# EAGLE schematic main (EAGLE 9.6.2)
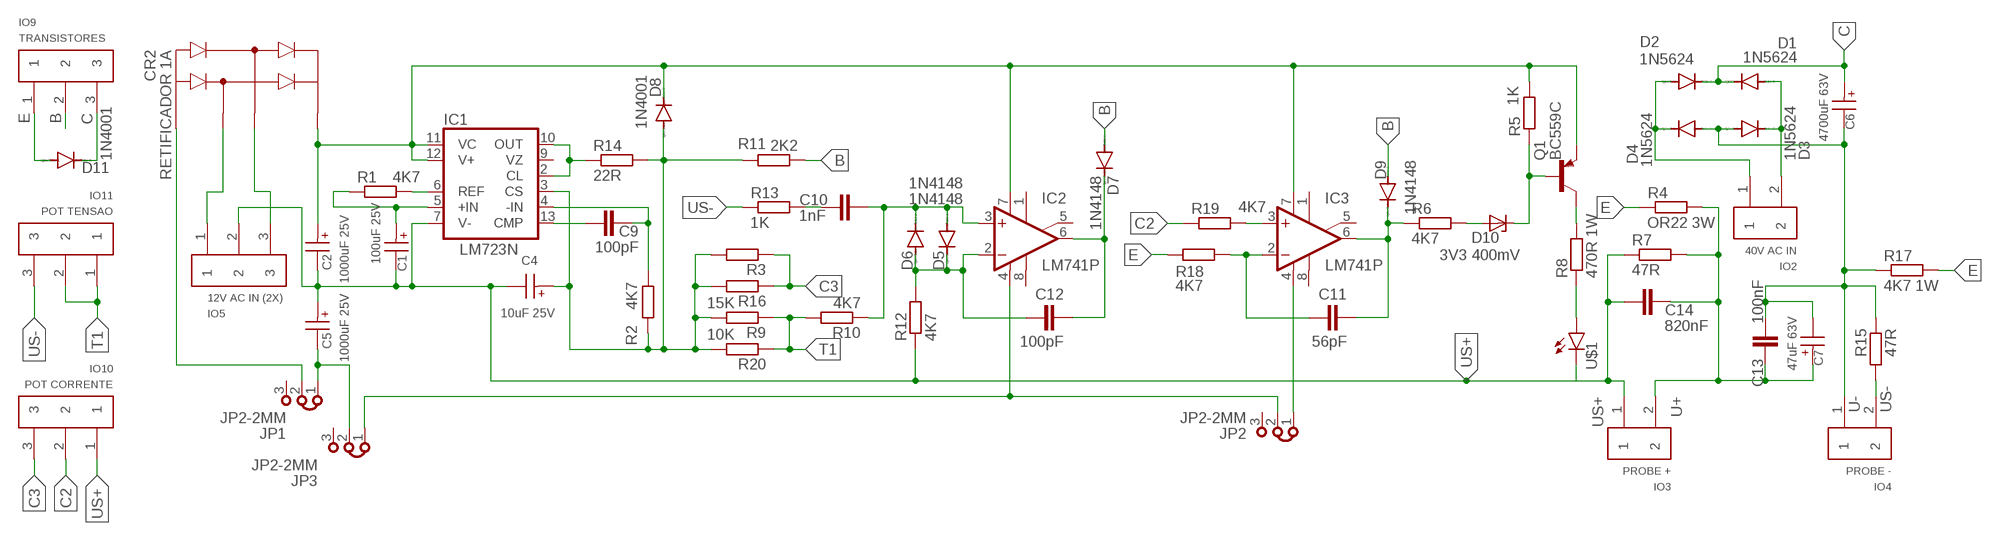
[diagram p0: schematic, sheet 1]

## Parts
C1  100uF 25V  WCAP-ATET_16X31.5_860131280009  [WCAP-ATET_16X31.5(DXL)]
C2  1000uF 25V  WCAP-ATET_16X31.5_860131280009  [WCAP-ATET_16X31.5(DXL)]
C4  10uF 25V  WCAP-ATET_16X31.5_860131280009  [WCAP-ATET_16X31.5(DXL)]
C5  1000uF 25V  WCAP-ATET_16X31.5_860131280009  [WCAP-ATET_16X31.5(DXL)]
C6  4700uF 63V  WCAP-AIG5_35X60_861021386035  [WCAP-AIG5_35X60(DXL)]
C7  47uF 63V  WCAP-AIG5_35X60_861021386035  [WCAP-AIG5_35X60(DXL)]
C9  100pF  C-EU025-025X050  [C025-025X050]
C10  1nF  C-EU025-025X050  [C025-025X050]
C11  56pF  C-EU025-025X050  [C025-025X050]
C12  100pF  C-EU025-025X050  [C025-025X050]
C13  100nF  C-EU025-025X050  [C025-025X050]
C14  820nF  C-EU025-025X050  [C025-025X050]
CR2  RETIFICADOR 1A  KBU8J-E4/51  [THT]
D1  1N5624  [DO201-15]
D2  1N5624  [DO201-15]
D3  1N5624  [DO201-15]
D4  1N5624  [DO201-15]
D5  1N4148  1N4148DO35-7  [DO35-7]
D6  1N4148  1N4148DO35-7  [DO35-7]
D7  1N4148  1N4148DO35-7  [DO35-7]
D8  1N4001  1N4148DO35-7  [DO35-7]
D9  1N4148  1N4148DO35-7  [DO35-7]
D10  3V3 400mV  ZENER-DIODEDO34-7  [DO34Z7]
D11  1N4001  1N4148DO35-7  [DO35-7]
IC1  LM723N  [DIL14]
IC2  LM741P  [DIL08]
IC3  LM741P  [DIL08]
IO2  40V AC IN  KRE-2P  [KRE-2P]
IO3  PROBE +  KRE-2P  [KRE-2P]
IO4  PROBE -  KRE-2P  [KRE-2P]
IO5  12V AC IN (2X)  KRE-3P  [KRE-3P]
IO9  TRANSISTORES  KRE-3P  [KRE-3P]
IO10  POT CORRENTE  KRE-3P  [KRE-3P]
IO11  POT TENSAO  KRE-3P  [KRE-3P]
JP1  JP2-2MM  JUMPERS_JP2-2MM  [JUMPERS_JP2-2MM]
JP2  JP2-2MM  JUMPERS_JP2-2MM  [JUMPERS_JP2-2MM]
JP3  JP2-2MM  JUMPERS_JP2-2MM  [JUMPERS_JP2-2MM]
Q1  BC559C  [TO92-EBC]
R1  4K7  R-EU_0204/7  [0204/7]
R2  4K7  R-EU_0204/7  [0204/7]
R3  R-EU_0204/7  [0204/7]
R4  OR22 3W  R-EU_0204/7  [0204/7]
R5  1K  R-EU_0204/7  [0204/7]
R6  4K7  R-EU_0204/7  [0204/7]
R7  47R  R-EU_0204/7  [0204/7]
R8  470R 1W  R-EU_0204/7  [0204/7]
R9  10K  R-EU_0204/7  [0204/7]
R10  4K7  R-EU_0204/7  [0204/7]
R11  2K2  R-EU_0204/7  [0204/7]
R12  4K7  R-EU_0204/7  [0204/7]
R13  1K  R-EU_0204/7  [0204/7]
R14  22R  R-EU_0204/7  [0204/7]
R15  47R  R-EU_0204/7  [0204/7]
R16  15K  R-EU_0204/7  [0204/7]
R17  4K7 1W  R-EU_0204/7  [0204/7]
R18  4K7  R-EU_0204/7  [0204/7]
R19  4K7  R-EU_0204/7  [0204/7]
R20  R-EU_0204/7  [0204/7]
U$1  CLIP  LED-CIRCULAR-5MM-VERMELHO  [LED-CIR-5MM-VERMELHO]

## Nets
B: D7.A D9.A IO9.2 R11.1
C: C6.1(+) D1.C D2.C D11.C IO9.3
C2: IO10.2 R19.1
C3: IO10.3 R3.1 R16.1
E: D11.A IO9.1 R4.1 R17.2 R18.1
N$7: CR2.2(~) IO5.1
N$8: CR2.3(~_1) IO5.3
N$9: C2.1(+) CR2.1(+) D8.C IC1.11(VC) IC1.12(V+) IC2.7(V+) IC3.7(V+) Q1.E R5.2
N$10: C1.1(+) IC1.5(+IN) R1.1
N$11: C5.2(-) JP1.1 JP3.2
N$12: CR2.4(-) JP1.2
N$14: IC1.6(REF) R1.2
N$15: C9.1 IC1.13(CMP)
N$16: C9.2 IC1.4(-IN) R2.2
N$17: D1.A D3.C IO2.2
N$18: D2.A D4.C IO2.1
N$19: C10.1 D5.A D6.C IC2.3(+IN) R10.1
N$20: IC1.2(CL) IC1.10(OUT) R14.1
N$21: C4.1(+) D8.A IC1.3(CS) R2.1 R3.2 R9.2 R11.2 R14.2 R16.2 R20.2
N$22: C12.1 D5.C D6.A IC2.2(-IN) R12.2
N$23: C10.2 R13.2
N$24: IC2.4(V-) JP2.2 JP3.1
N$25: IC3.4(V-) JP2.1
N$27: C11.1 IC3.2(-IN) R18.2
N$28: IC3.3(+IN) R19.2
N$29: D10.A R6.2
N$30: C12.2 D7.C IC2.6(OUT)
N$31: C11.2 D9.C IC3.6(OUT) R6.1
N$34: R8.1 U$1.A(ANODE)
N$35: Q1.C R8.2
N$36: D10.C Q1.B R5.1
T1: IO11.1 IO11.2 R9.1 R10.2 R20.1
U+: C7.1(+) C13.1 C14.1 IO3.2 R4.2 R7.2
U-: C6.2(-) C7.2(-) C13.2 D3.A D4.A IO4.1 R15.2 R17.1
US+: C1.2(-) C2.2(-) C4.2(-) C5.1(+) C14.2 IC1.7(V-) IO3.1 IO5.2 IO10.1 R7.1 R12.1 U$1.K(CATHODE)
US-: IO4.2 IO11.3 R13.1 R15.1
Unconnected: IC1.9(VZ) IC2.1(ON1) IC2.5(ON2) IC2.8(OPT) IC3.1(ON1) IC3.5(ON2) IC3.8(OPT) JP1.3 JP2.3 JP3.3

## Library data of the parts
C1 C2 C4 C5 = Wurth_Capacitors_WCAP-ATET:WCAP-ATET_16X31.5: WCAP-ATET Aluminium Electrolytic Capacitors High Temperature +125 °C Characteristics High operating temperature product series Mounting style: THT Radial Capacitance range: 0.47 µF ‒ 1000 µF Capacitance tolerance: ±20 % Voltage range (UR): 10 ‒ 350 V(DC) Operating temperature: -40 °C up to +125 °C for UR ≤100 V(DC) -25 °C up to +125 °C for UR >100 V(DC) Endurance: 1000 ‒ 2000 h @ +125 °C Dimensions (DxL) in mm: 5.0 x 11.0 up to 16.0 x 31.5 Recommended soldering: Wave soldering Applications High operating temperature applications Filtering Smoothing Energy storage Coupling e.g. Switched-mode power supply, AC/DC converter, adapter, charger, digital camera <https://www.we-online.com/catalog/media/o14728v209%20Family_WCAP-ATET.jpg> Details see: https://www.we-online.com/catalog/en/WCAP-ATET/ Updated by yingchun,Shan;2020-02-28 2020(C) Würth Elektronik; DATASHEET-URL: https://www.we-online.com/catalog/datasheet/860131280009.pdf; DF: 12%; DIAMETER: 16mm; I-LEAK: 329uA; I-RIPPLE: 230mA; L: 31.5mm; OPERATING-TEMPERATURE: -25 °C up to +125 °C; PART-NUMBER: 860131280009; PITCH: 7.5mm; TECHNICAL-REFERENCE: ATCK315470M350DSPADB000; VALUE: 47 µF; VR: 350V(DC)
C6 C7 = Wurth_Capacitors_WCAP-AIG5:WCAP-AIG5_35X60: WCAP-AIG5 Aluminum Electrolytic Capacitors General Purpose +105 °C Characteristics General purpose product series with max. operating temperature of +105 °C High permissible ripple current Mounting style: Snap-In Capacitance range: 33 µF ‒ 10000 µF Capacitance tolerance: ±20 % Voltage range (UR): 63 ‒ 450 V(DC) Operating temperature: -40 °C up to +105 °C for UR ≤ 100 V(DC) -25 °C up to +105 °C for UR > 100 V(DC) Endurance: 2000 h @ +105 °C Dimensions (DxL) in mm: 22.0 x 26.0 up to 35.0 x 60.0 Recommended soldering: Wave soldering Applications High operating temperature applications Filtering Smoothing Energy storage e.g. Personal and industrial computer power supply, server power supply, drive circuit, DC/AC inverter DXL=DiameterxLength <https://www.we-online.com/catalog/media/o14719v209%20Family_WCAP-AIG5.jpg> Details see: https://www.we-online.com/catalog/en/WCAP-AIG5/ Updated by yingchun,Shan;2020-03-017 2020(C) Würth Elektronik; DATASHEET-URL: https://www.we-online.com/catalog/datasheet/861021386035.pdf; DF: 20%; DIAMETER: 35mm; I-LEAK: 20uA; I-RIPPLE: 2850mA; L: 60mm; OPERATING-TEMPERATURE: - 25°C up to105°C; PART-NUMBER: 861021386035; PITCH: 10mm; TECHNICAL-REFERENCE: ANJQ600102M400DSIC2B000; VALUE: 1000uF; VR: 400V(DC)
C9-C14 = rcl:C-EU: CAPACITOR, European symbol; SPICEPREFIX: C
CR2 = Bridge Rectifiers:KBU8J-E4/51: BRIDGE RECT 1PHASE 600V 8A KBU Manufacturer's datasheet <http://www.vishay.com/docs/88658/kbu8.pdf>; CREATED_BY: PCBLayout.com; DIGIKEY_PARTNO: KBU8J-E4/51GI-ND; MANUFACTURER: Vishay Semiconductor Diodes Division; MPN: KBU8J-E4/51; PACKAGE: THT
D1-D4 = diode:1N5624: DIODE controlled avalanche rectifier
D5-D9 D11 = diode:1N4148: DIODE high speed (Philips)
D10 = diode:ZENER-DIODE: Z-Diode
IC1 = linear:*723: Positive VOLTAGE REGULATOR
IC2 IC3 = linear:*741: OP AMP
IO2-IO4 = kre:KRE-2P: KRE Conector 2P
IO5 = kre:KRE-3P: KRE Conector 3P
IO9-IO11 = Conectores KRE:KRE-3P: KRE Conector 3P
JP1-JP3 = 52101-101-REV-A_v16:JUMPERS_JP2-: Jumper/Bridge
Q1 = transistor-pnp:BC559*: PNP Transistror
R1-R20 = rcl:R-EU_: RESISTOR, European symbol; SPICEPREFIX: R
U$1 = LED:LED-CIRCULAR-5MM